# Altium schematic sheet Main.SchDoc: Наименование
size 420 x 297 mm; ApprovedBy: Утвердил; CheckedBy: Проверил; Author: Разработал; CompanyName: Организация; SheetNumber: 1; SheetTotal: 1; PageSetup: Record=PageOptions|CenterHorizontal=True|CenterVertical=True|PrintScale=0.94|XCorrection=1.00|YCorrection=1.00|PrintKind=1|BorderSize=5000000|LeftOffset=0|BottomOffset=0|Orientation=1|PaperLength=1000|PaperWidth=1000|Scale=100|PaperSource=7|PrintQuality=-4|MediaType=1|DitherType=10|PaperKind=A4|PrintScaleMode=1; DecimalNumber: Децимальный номер; HeadOfSector: Нач. сектора; MainDevice: Перв.примен.; Name1: Наименование1; n_kontr: Н. Контр; t_kontr: Т. Контр; lit_A: О; Name2: Наименование2; DocumentName: Sheet1.SCHDOC
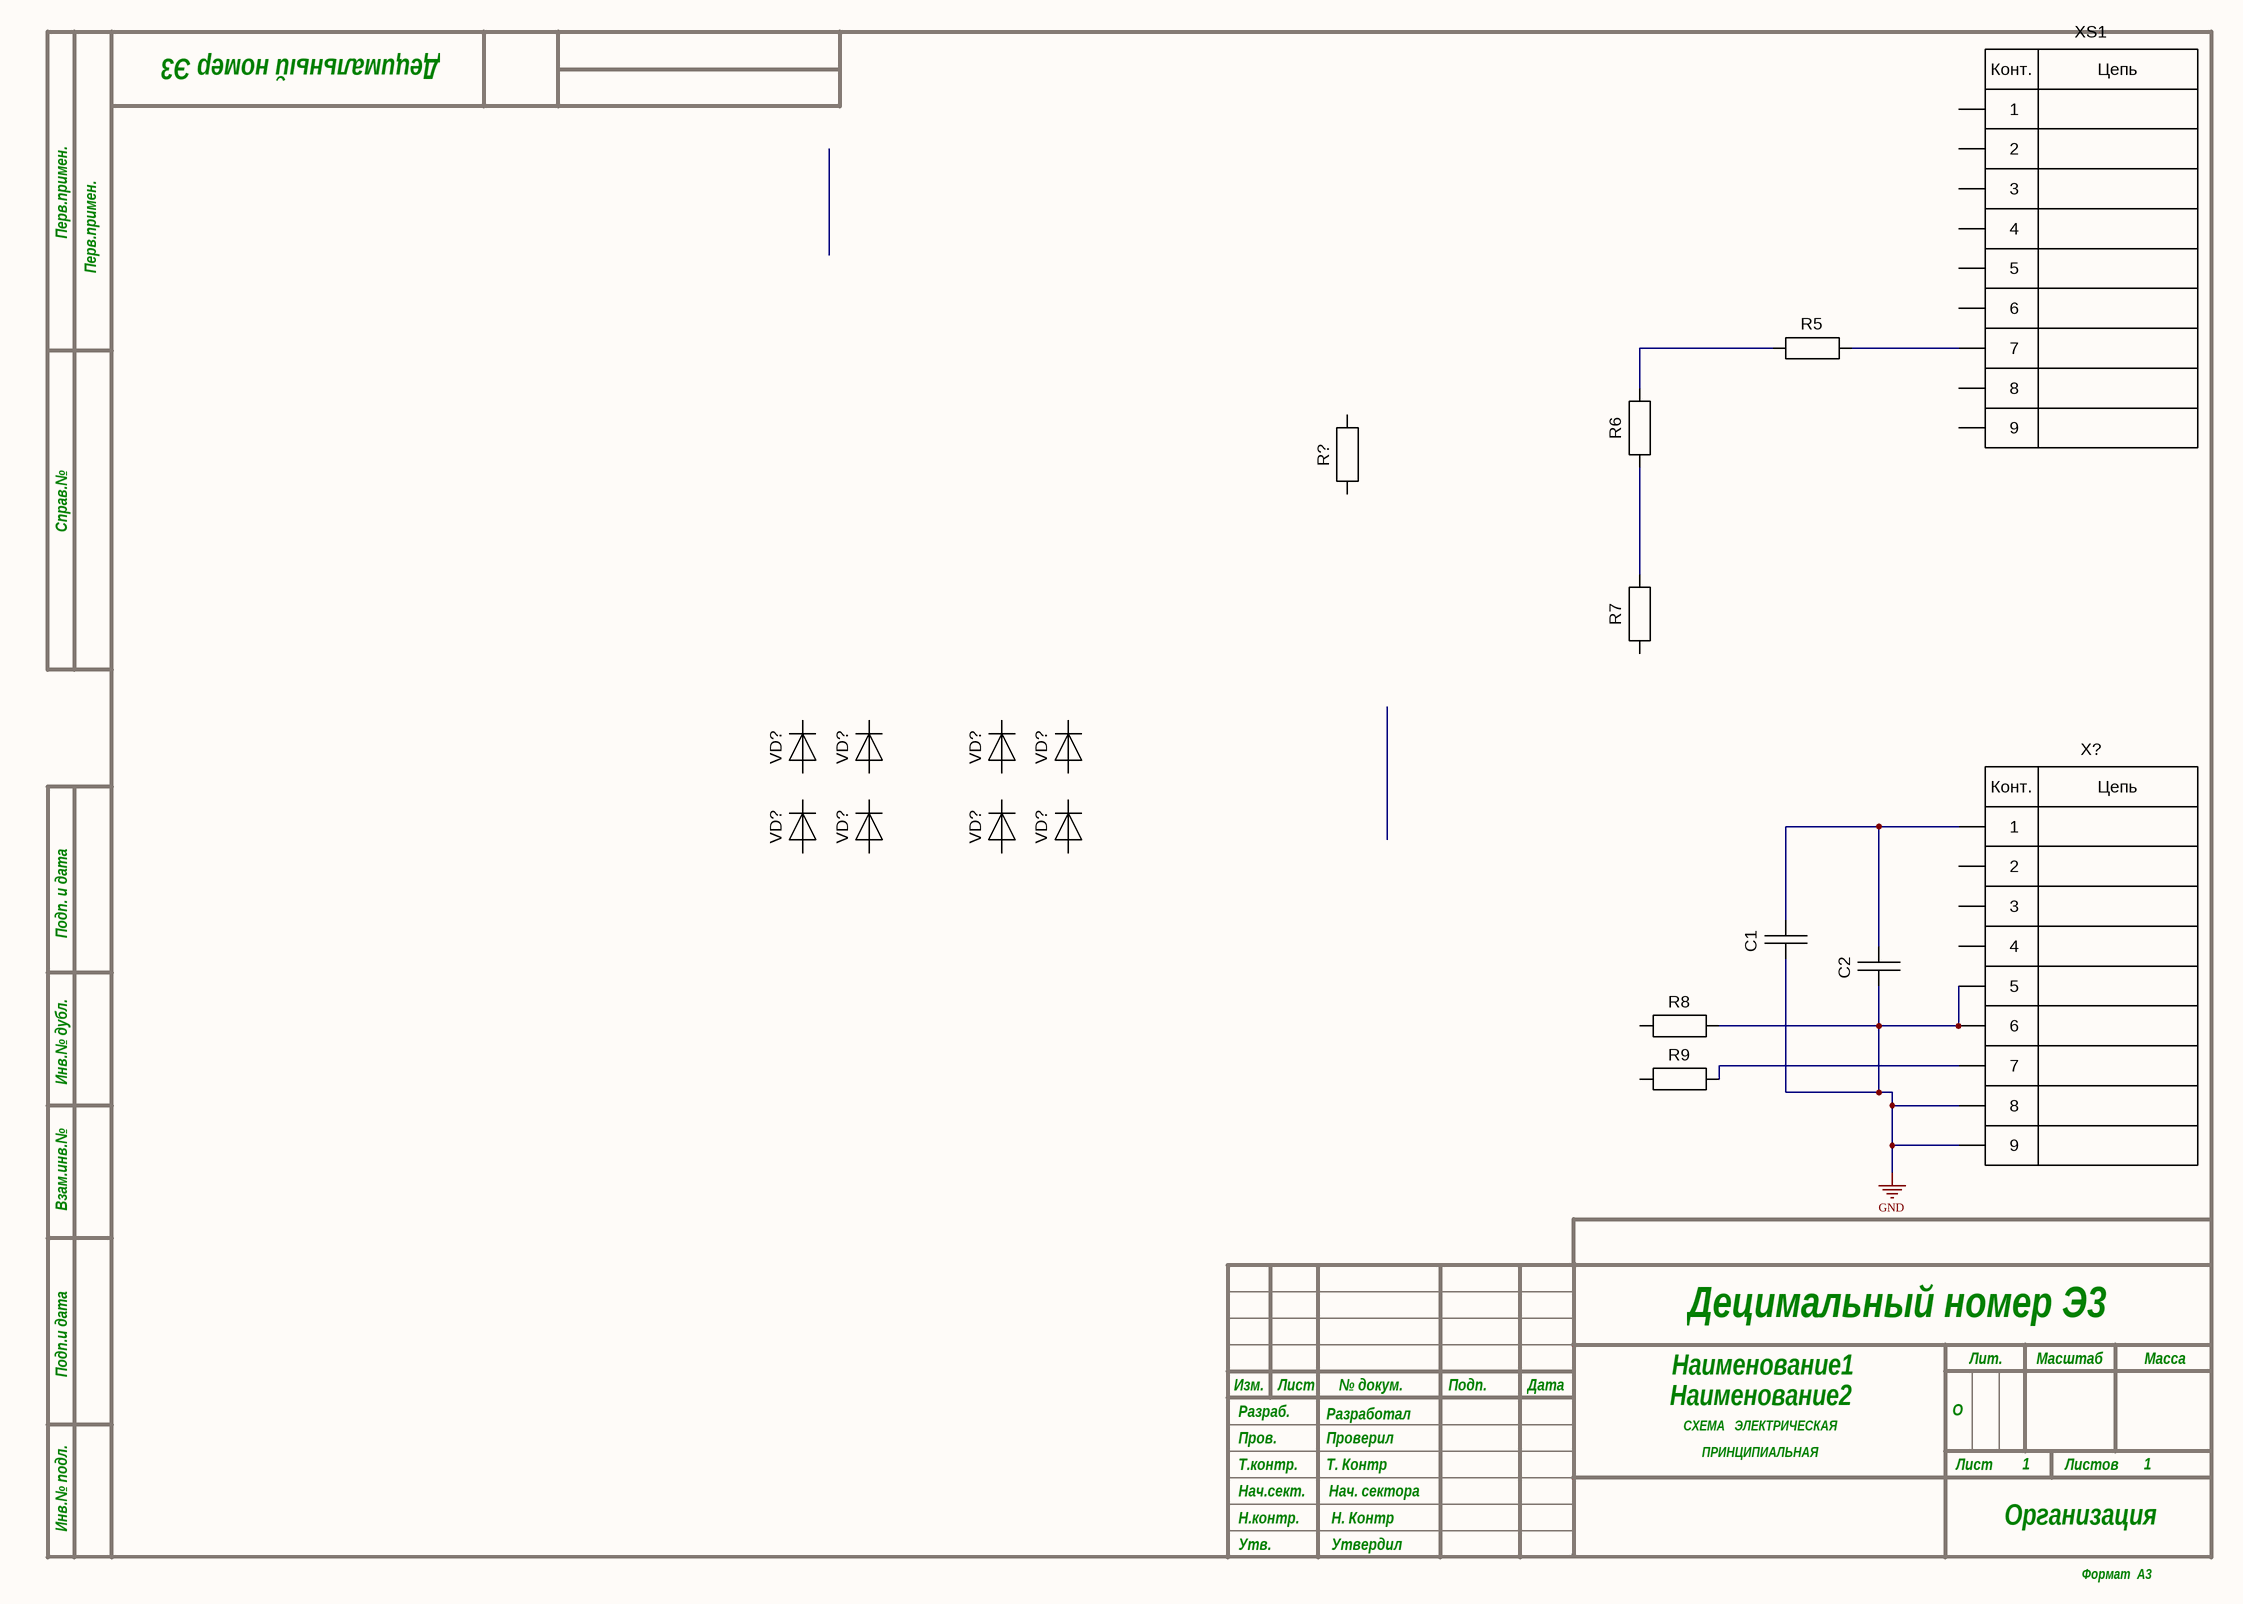
[diagram p0: Main.SchDoc]

## Parts
(Parts that share a designator on the sheet are numbered #1, #2 ... from top to bottom, then left to right.)
C1  C  (value not drawn)
C2  C  (value not drawn)
R5  R  [R_1206]  (value not drawn)
R6  R  [R_1206]  (value not drawn)
R7  R  [R_1206]  (value not drawn)
R8  R  [R_1206]  (value not drawn)
R9  R  [R_1206]  (value not drawn)
R?  R  [R_1206]  (value not drawn)
VD?#1  VD  [SMB]  (value not drawn)
VD?#2  VD  [SMB]  (value not drawn)
VD?#3  VD  [SMB]  (value not drawn)
VD?#4  VD  [SMB]  (value not drawn)
VD?#5  VD  [SMB]  (value not drawn)
VD?#6  VD  [SMB]  (value not drawn)
VD?#7  VD  [SMB]  (value not drawn)
VD?#8  VD  [SMB]  (value not drawn)
X?  X_9  [DRB-9FB]  (value not drawn)
XS1  X_9  [DRB-9MB]  (value not drawn)

## Nets
GND: C1.1 C2.1 R8.2 X?.5 X?.6 X?.8 X?.9
NetC1_2: C1.2 C2.2 X?.1
NetR5_1: R5.1 R6.2
NetR5_2: R5.2 XS1.7
NetR6_1: R6.1 R7.2
NetR9_2: R9.2 X?.7

Not connected (* = marked no-connect by the designer): R7 1; R8 1; R9 1; R? 1 2; VD?#1 1(A) 2(C); VD?#2 1(A) 2(C); VD?#3 1(A) 2(C); VD?#4 1(A) 2(C); VD?#5 1(A) 2(C); VD?#6 1(A) 2(C); VD?#7 1(A) 2(C); VD?#8 1(A) 2(C); X? 2 3 4; XS1 1 2 3 4 5 6 8 9

## Notes on the sheet
- Перв.примен.
- Справ.№
- Подп. и дата
- Инв.№ дубл.
- Взам.инв.№
- Подп.и дата
- Разраб.
- Изм.
- Лист
- № докум.
- Подп.
- Дата
- Лит.
- Масштаб
- Масса
- Т.контр.
- Пров.
- СХЕМА   ЭЛЕКТРИЧЕСКАЯ
- ПРИНЦИПИАЛЬНАЯ
- Листов
- Инв.№ подл.
- Утв.
- Н.контр.
- Нач.сект.
- Формат  A3
- (in symbol Вилка DRB-9MB) Конт.; Цепь
- (in symbol Розетка DRB-9FB) Конт.; Цепь

## Library data of the parts
C1 C2 = Конденсатор MAL215253479E3 (47 мкФ +-20% 250 В): Capacitance: 47u; Tolerance: ±20%; Dielectric Type: Aluminum Electrolytic; Maximum Voltage: 250V; Part Number: Конденсатор MAL215253479E3 (47 мкФ +-20% 250 В); HelpURL: http://www.vishay.com/docs/28320/152rmh.pdf
R5-R9 = Резистор RC1206JR-071KL (1 кОм +-5%): Resistance: 1k; Tolerance: ±5%; Power: 0.25 W; Maximum Working Voltage: 200V; Maximum Overload Voltage: 400V; Part Number: Резистор RC1206JR-071KL (1 кОм +-5%); HelpURL: http://www.yageo.ru/pdf/RC1206.pdf
R? = Резистор RC1206FR-07100KL (100 кОм +-1%): Resistance: 100k; Tolerance: ±1%; Power: 0.25 W; Maximum Working Voltage: 200V; Maximum Overload Voltage: 400V; Part Number: Резистор RC1206FR-07100KL (100 кОм +-1%); HelpURL: http://www.yageo.ru/pdf/RC1206.pdf
VD?#1-VD?#8 = Диод 10BQ040PbF: Reverse Voltage: 40 V; Forward Current: 1 A; Peak Current: 430 A; Part Number: Диод 10BQ040PbF; HelpURL: http://www.irf.com/product-info/datasheets/data/10bq40.pdf; Recovery Time: -
X? = Розетка DRB-9FB: Part Number: Розетка DRB-9FB; HelpURL: http://lib.chipdip.ru/792/DOC000792160.pdf
XS1 = Вилка DRB-9MB: Part Number: Вилка DRB-9MB; HelpURL: http://www.brownbear.ru/components/drb-9mb.html